# EAGLE design Super_Headphones (EAGLE 9.6.2)
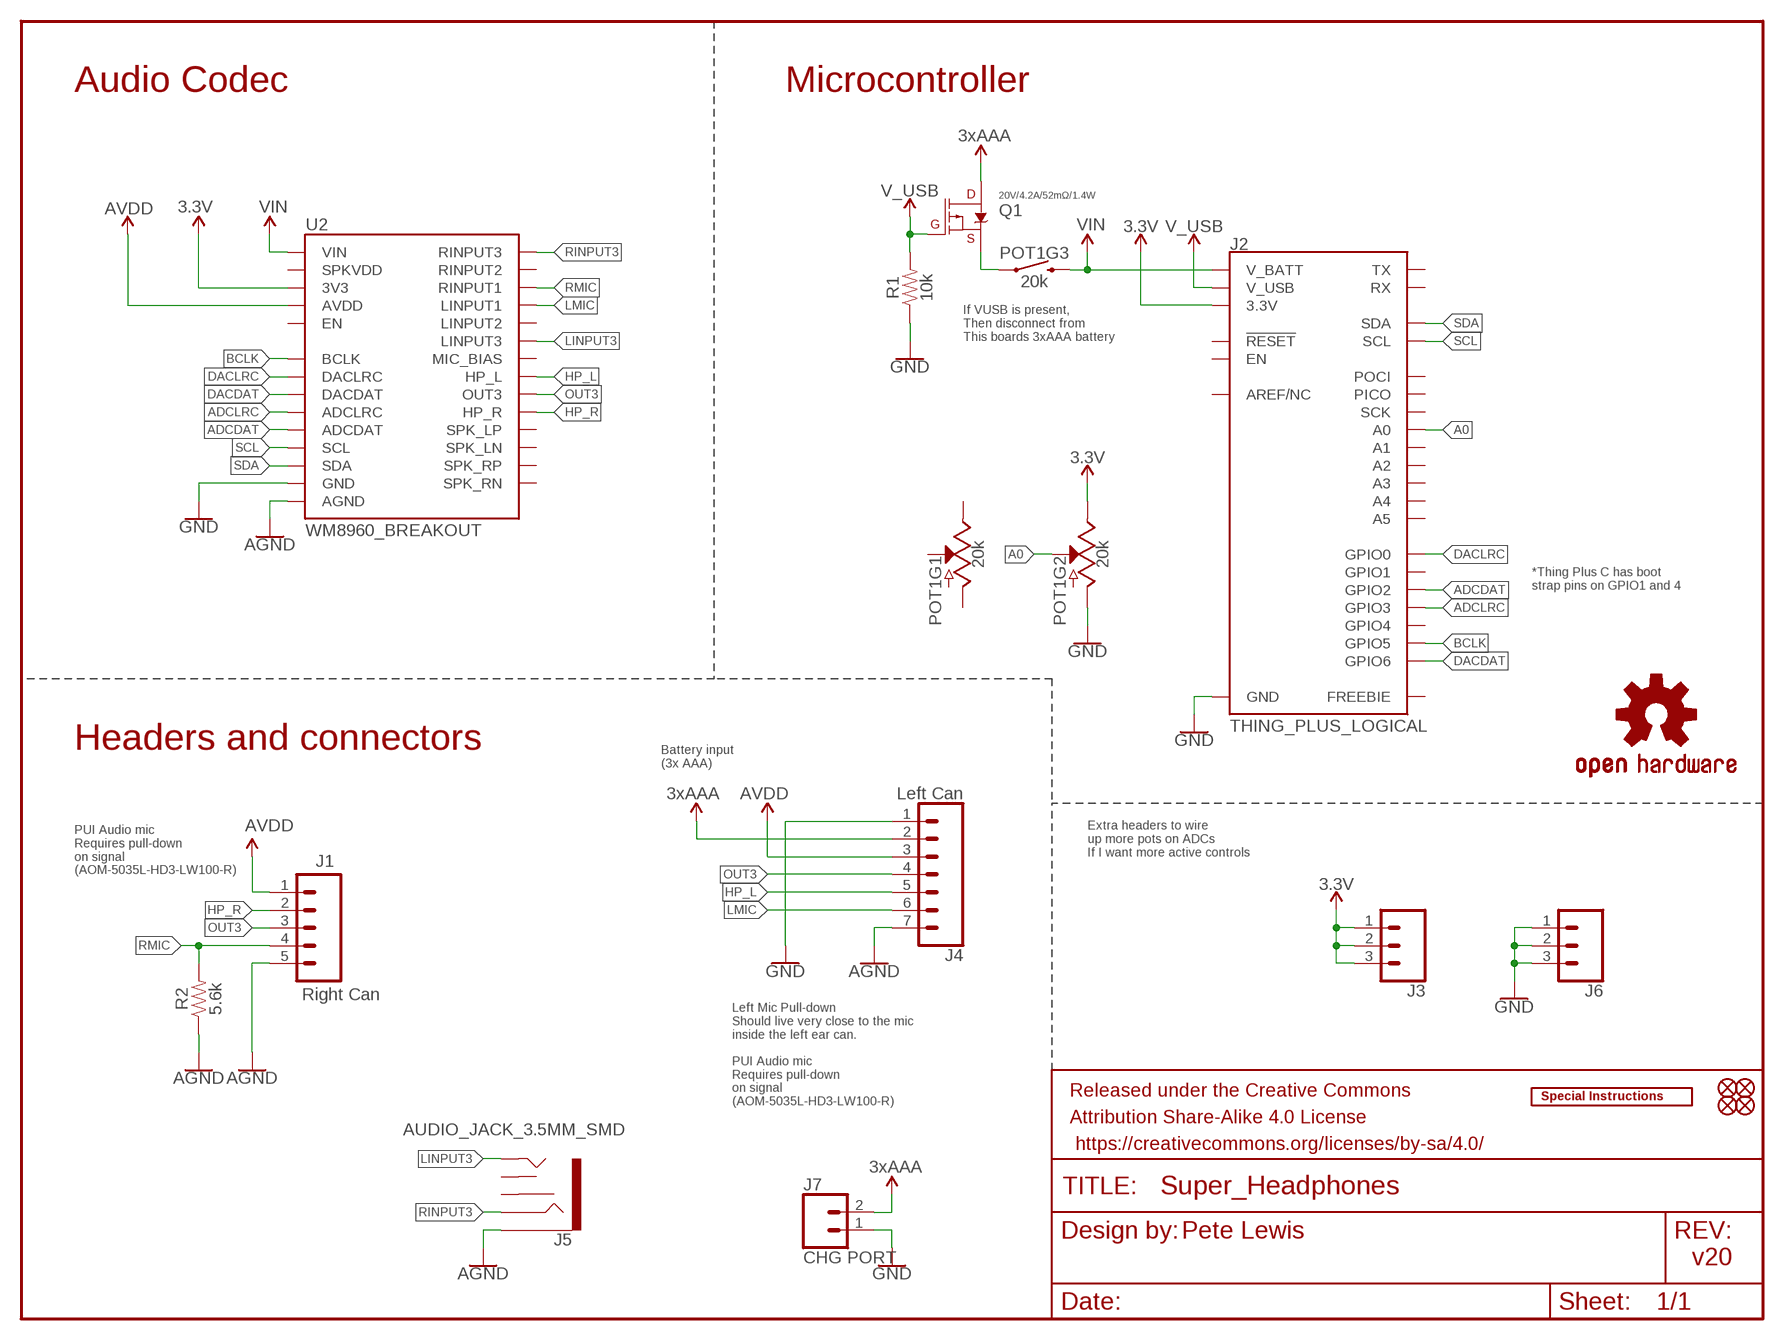
[diagram p0: schematic, sheet 1]

## Parts
FD1  FIDUCIALUFIDUCIAL  [FIDUCIAL-MICRO]
FD2  FIDUCIALUFIDUCIAL  [FIDUCIAL-MICRO]
FD3  FIDUCIALUFIDUCIAL  [FIDUCIAL-MICRO]
FD4  FIDUCIALUFIDUCIAL  [FIDUCIAL-MICRO]
FRAME2  FRAME-LETTER  [CREATIVE_COMMONS]
J1  Right Can  CONN_05NO_SILK  [1X05_NO_SILK]
J2  THING_PLUS_LOGICAL  [THING_PLUS]
J3  CONN_031X03_NO_SILK  [1X03_NO_SILK]
J4  Left Can  CONN_07NO_SILK  [1X07_NO_SILK]
J5  AUDIO_JACK_3.5MM_SMD  [AUDIO-JACK-3.5MM-SMD]
J6  CONN_031X03_NO_SILK  [1X03_NO_SILK]
J7  CHG PORT  CONN_021X02_NO_SILK  [1X02_NO_SILK]
LOGO4  OSHW-LOGOM  [OSHW-LOGO-M]
LOGO5  SPECIAL_INSTRUCTIONS-ORDERING  [ORDERING_INSTRUCTIONS]
POT1  20k  POTENTIOMETER_DUAL_W/SWITCH  [POT-DUAL-SWITCH-PTH]
Q1  20V/4.2A/52mΩ/1.4W  MOSFET_PCH-DMG2305UX-7  [SOT23-3]
R1  10k  10KOHM-0603-1/10W-1%  [0603]
R2  5.6k  5.6KOHM-0603-1/10W-1%  [0603]
U2  WM8960_BREAKOUT  [WM8960_BREAKOUT]

## Nets
3.3V: J2.27(3.3V) J3.1 J3.2 J3.3 POT1.B3(E) U2.3V3
3XAAA: J4.2 J7.2 Q1.3(D) ; supply symbol labelled 3xAAA
A0: J2.24(A0) POT1.B2(S)
ADCDAT: J2.7(GPIO2) U2.ADCDAT
ADCLRC: J2.6(GPIO3) U2.ADCLRC
AGND: J1.5 J4.7 J5.SLEEVE R2.1 U2.GND1(AGND)
AVDD: J1.1 J4.3 U2.AVDD
BCLK: J2.4(GPIO5) U2.BCLK
DACDAT: J2.3(GPIO6) U2.DACDAT
DACLRC: J2.9(GPIO0) U2.DACLRC
GND: J2.25(GND) J4.1 J6.1 J6.2 J6.3 J7.1 POT1.B1(A) R1.1 U2.GND2(GND) U2.GND3(GND) U2.GND4(GND) U2.GND5(GND) U2.GND6(GND)
HP_L: J4.5 U2.HP_L
HP_R: J1.2 U2.HP_R
LINPUT3: J5.TIP U2.LINPUT3
LMIC: J4.6 U2.LINPUT1
N$6: POT1.SW1 Q1.2(S)
OUT3: J1.3 J4.4 U2.OUT3
RINPUT3: J5.RING U2.RINPUT3
RMIC: J1.4 R2.2 U2.RINPUT1
SCL: J2.2(SCL) U2.SCL
SDA: J2.1(SDA) U2.SDA
V_USB [power]: J2.10(V_USB) Q1.1(G) R1.2
VIN: J2.12(V_BATT) POT1.SW2 U2.VIN
Unconnected: J2.5(GPIO4) J2.8(GPIO1) J2.11(EN) J2.13(FREEBIE) J2.14(TX) J2.15(RX) J2.16(POCI) J2.17(PICO) J2.18(SCK) J2.19(A5) J2.20(A4) J2.21(A3) J2.22(A2) J2.23(A1) J2.26(AREF/NC) J2.28(!RESET) J5.RSH J5.TSH POT1.A1(A) POT1.A2(S) POT1.A3(E) U2.EN U2.LINPUT2 U2.MIC_BIAS U2.RINPUT2 U2.SPK_LN U2.SPK_LP U2.SPK_RN U2.SPK_RP U2.SPKVDD

## Notes on the sheet
- Audio Codec | Microcontroller
- If VUSB is present,
  Then disconnect from
  This boards 3xAAA battery
- *Thing Plus C has boot 
  strap pins on GPIO1 and 4
- Headers and connectors
- Battery input
  (3x AAA)
- Extra headers to wire
  up more pots on ADCs
  If I want more active controls
- PUI Audio mic 
  Requires pull-down 
  on signal
  (AOM-5035L-HD3-LW100-R)
- Left Mic Pull-down
  Should live very close to the mic
  inside the left ear can.
  
  PUI Audio mic 
  Requires pull-down 
  on signal
  (AOM-5035L-HD3-LW100-R)
- Pete Lewis
- v20

## Library data of the parts
FD1-FD4 = SparkFun-Aesthetics:FIDUCIAL: Fiducial Alignment Points Point-of-reference for pick-and-place machines and other optical instruments.
FRAME2 = SparkFun-Aesthetics:FRAME-LETTER: Schematic Frame - Letter Standard 8.5x11 US Letter frame
J1 = SparkFun-Connectors:CONN_05: Multi connection point. Often used as Generic Header-pin footprint for 0.1 inch spaced/style header connections On any of the 0.1 inch spaced packages, you can populate with these: Break Away Headers - Straight <https://www.sparkfun.com/products/116> (PRT-00116) Break Away Male Headers - Right Angle <https://www.sparkfun.com/products/553> (PRT-00553) Female Headers <https://www.sparkfun.com/products/115> (PRT-00115) Break Away Headers - Machine Pin <https://www.sparkfun.com/products/117> (PRT-00117) Break Away Female Headers - Swiss Machine Pin <https://www.sparkfun.com/products/743> (PRT-00743) For SCREWTERMINALS and SPRING TERMINALS visit here: Screw Terimnals on SparkFun.com <https://www.sparkfun.com/search/results?term=Screw+Terminals> (5mm/3.5mm/2.54mm spacing) This device is also useful as a general connection point to wire up your design to another part of your project. Our various solder wires solder well into these plated through hole pads. Hook-Up Wire - Assortment (Stranded, 22 AWG) <https://www.sparkfun.com/products/11375> (PRT-11375) Hook-Up Wire - Assortment (Solid Core, 22 AWG) <https://www.sparkfun.com/products/11367> (PRT-11367) View the entire wire category on our website here <https://www.sparkfun.com/categories/141> Special notes: Molex polarized connector foot print use with SKU : PRT-08231 with associated crimp pins and housings. 1MM SMD Version SKU: PRT-10208
J2 = SparkFun-Boards:THING_PLUS_LOGICAL
J3 J6 = SparkFun-Connectors:CONN_03: Multi connection point. Often used as Generic Header-pin footprint for 0.1 inch spaced/style header connections On any of the 0.1 inch spaced packages, you can populate with these: Break Away Headers - Straight <https://www.sparkfun.com/products/116> (PRT-00116) Break Away Male Headers - Right Angle <https://www.sparkfun.com/products/553> (PRT-00553) Female Headers <https://www.sparkfun.com/products/115> (PRT-00115) Break Away Headers - Machine Pin <https://www.sparkfun.com/products/117> (PRT-00117) Break Away Female Headers - Swiss Machine Pin <https://www.sparkfun.com/products/743> (PRT-00743) Stackable Header - 3 Pin (Female, 0.1") <https://www.sparkfun.com/products/13875> (PRT-13875) For SCREWTERMINALS and SPRING TERMINALS visit here: Screw Terimnals on SparkFun.com <https://www.sparkfun.com/search/results?term=Screw+Terminals> (5mm/3.5mm/2.54mm spacing) This device is also useful as a general connection point to wire up your design to another part of your project. Our various solder wires solder well into these plated through hole pads. Hook-Up Wire - Assortment (Stranded, 22 AWG) <https://www.sparkfun.com/products/11375> (PRT-11375) Hook-Up Wire - Assortment (Solid Core, 22 AWG) <https://www.sparkfun.com/products/11367> (PRT-11367) View the entire wire category on our website here <https://www.sparkfun.com/categories/141> Special notes: Molex polarized connector foot print use with SKU : PRT-08232 with associated crimp pins and housings.
J4 = SparkFun-Connectors:CONN_07: Multi connection point. Often used as Generic Header-pin footprint for 0.1 inch spaced/style header connections On any of the 0.1 inch spaced packages, you can populate with these: Break Away Headers - Straight <https://www.sparkfun.com/products/116> (PRT-00116) Break Away Male Headers - Right Angle <https://www.sparkfun.com/products/553> (PRT-00553) Female Headers <https://www.sparkfun.com/products/115> (PRT-00115) Break Away Headers - Machine Pin <https://www.sparkfun.com/products/117> (PRT-00117) Break Away Female Headers - Swiss Machine Pin <https://www.sparkfun.com/products/743> (PRT-00743) For SCREWTERMINALS and SPRING TERMINALS visit here: Screw Terimnals on SparkFun.com <https://www.sparkfun.com/search/results?term=Screw+Terminals> (5mm/3.5mm/2.54mm spacing) This device is also useful as a general connection point to wire up your design to another part of your project. Our various solder wires solder well into these plated through hole pads. Hook-Up Wire - Assortment (Stranded, 22 AWG) <https://www.sparkfun.com/products/11375> (PRT-11375) Hook-Up Wire - Assortment (Solid Core, 22 AWG) <https://www.sparkfun.com/products/11367> (PRT-11367) View the entire wire category on our website here <https://www.sparkfun.com/categories/141> Special notes: Molex polarized connector foot print use with SKU : PRT-08231 with associated crimp pins and housings. 1MM SMD Version SKU: PRT-10208 NOTES ON THE VARIANTS LOCK and LOCK_LONGPADS... This footprint was designed to help hold the alignment of a through-hole component (i.e. 6-pin header) while soldering it into place. You may notice that each hole has been shifted either up or down by 0.005 of an inch from it's more standard position (which is a perfectly straight line). This slight alteration caused the pins (the squares in the middle) to touch the edges of the holes. Because they are alternating, it causes a "brace" to hold the component in place. 0.005 has proven to be the perfect amount of "off-center" position when using our standard breakaway headers. Although looks a little odd when you look at the bare footprint, once you have a header in there, the alteration is very hard to notice. Also,if you push a header all the way into place, it is covered up entirely on the bottom side.
J5 = SparkFun-Connectors:AUDIO_JACK_3.5MM: Audio Jack 3.5mm variants of PTH and SMT stereo audio jack with bypass switches. SparkFun Products: SparkFun SparkPunk Sound Kit <[https://www.sparkfun.com/products/11177]> - PTH MP3 Trigger <https://www.sparkfun.com/products/13720> -3.5mm SMD SparkFun PicoBoard <https://www.sparkfun.com/products/11888>- 2.5mm SMD; PROD_ID: CONN-10353
J7 = SparkFun-Connectors:CONN_02: Multi connection point. Often used as Generic Header-pin footprint for 0.1 inch spaced/style header connections On any of the 0.1 inch spaced packages, you can populate with these: Break Away Headers - Straight <https://www.sparkfun.com/products/116> (PRT-00116) Break Away Male Headers - Right Angle <https://www.sparkfun.com/products/553> (PRT-00553) Female Headers <https://www.sparkfun.com/products/115> (PRT-00115) Break Away Headers - Machine Pin <https://www.sparkfun.com/products/117> (PRT-00117) Break Away Female Headers - Swiss Machine Pin <https://www.sparkfun.com/products/743> (PRT-00743) For SCREWTERMINALS and SPRING TERMINALS visit here: Screw Terimnals on SparkFun.com <https://www.sparkfun.com/search/results?term=Screw+Terminals> (5mm/3.5mm/2.54mm spacing) This device is also useful as a general connection point to wire up your design to another part of your project. Our various solder wires solder well into these plated through hole pads. Hook-Up Wire - Assortment (Stranded, 22 AWG) <https://www.sparkfun.com/products/11375> (PRT-11375) Hook-Up Wire - Assortment (Solid Core, 22 AWG) <https://www.sparkfun.com/products/11367> (PRT-11367) View the entire wire category on our website here <https://www.sparkfun.com/categories/141> Special notes: Molex polarized connector foot print use with: PRT-08233 with associated crimp pins and housings. 2.54_SCREWTERM for use with PRT-10571. 3.5mm Screw Terminal footprints for PRT-08084 5mm Screw Terminal footprints for use with PRT-08432
LOGO4 = SparkFun-Aesthetics:OSHW-LOGO: Open-Source Hardware (OSHW) Logo This logo indicates the piece of hardware it is found on incorporates a OSHW license and/or adheres to the definition of open source hardware found here: http://freedomdefined.org/OSHW
LOGO5 = SparkFun-Aesthetics:SPECIAL_INSTRUCTIONS: Special Ordering/Production Instructions Alert Symbol for special PCB ordering instructions or unique production process warnings. Ordering Instructions Production Instructions Types of information that should be added to box: Copper weight Soldermask color Silk color PCB thickness Number of layers PCB Standard: 1.6mm FR4 1 oz copper immersion silver plating red soldermask white silkscreen Types of information that should be added to box: Special wash requirements Depaneling instructions Humidification Glue curing Default text settings: 0.07 inch 9% ratio 50% line distance
POT1 = SparkFun-Resistors:POTENTIOMETER_DUAL_W/SWITCH; PROD_ID: RES-13814
Q1 = SparkFun-DiscreteSemi:MOSFET_PCH: P-channel MOSFETs Voltage controlled devices that allow control of high current outputs. SparkFun Products: SparkFun ESP32 Thing <https://www.sparkfun.com/products/13907> SparkFun ESP8266 Thing <https://www.sparkfun.com/products/13231> SparkFun Pi Servo HAT V2 <https://www.sparkfun.com/products/15316> DMG2305UX-7 (20V/4.2A/SOT23-3); PROD_ID: TRANS-14388
R1 = SparkFun-Resistors:10KOHM: 10kΩ resistor A resistor is a passive two-terminal electrical component that implements electrical resistance as a circuit element. Resistors act to reduce current flow, and, at the same time, act to lower voltage levels within circuits. - Wikipedia; PROD_ID: RES-00824
R2 = SparkFun-Resistors:5.6KOHM: 5.6kΩ resistor A resistor is a passive two-terminal electrical component that implements electrical resistance as a circuit element. Resistors act to reduce current flow, and, at the same time, act to lower voltage levels within circuits. - Wikipedia; PROD_ID: RES-12378
U2 = wm8960:WM8960_BREAKOUT

## Net classes
0 default: width 0.127 mm, drill 0.305 mm
1 power: width 0.305 mm, drill 0.305 mm

## Board
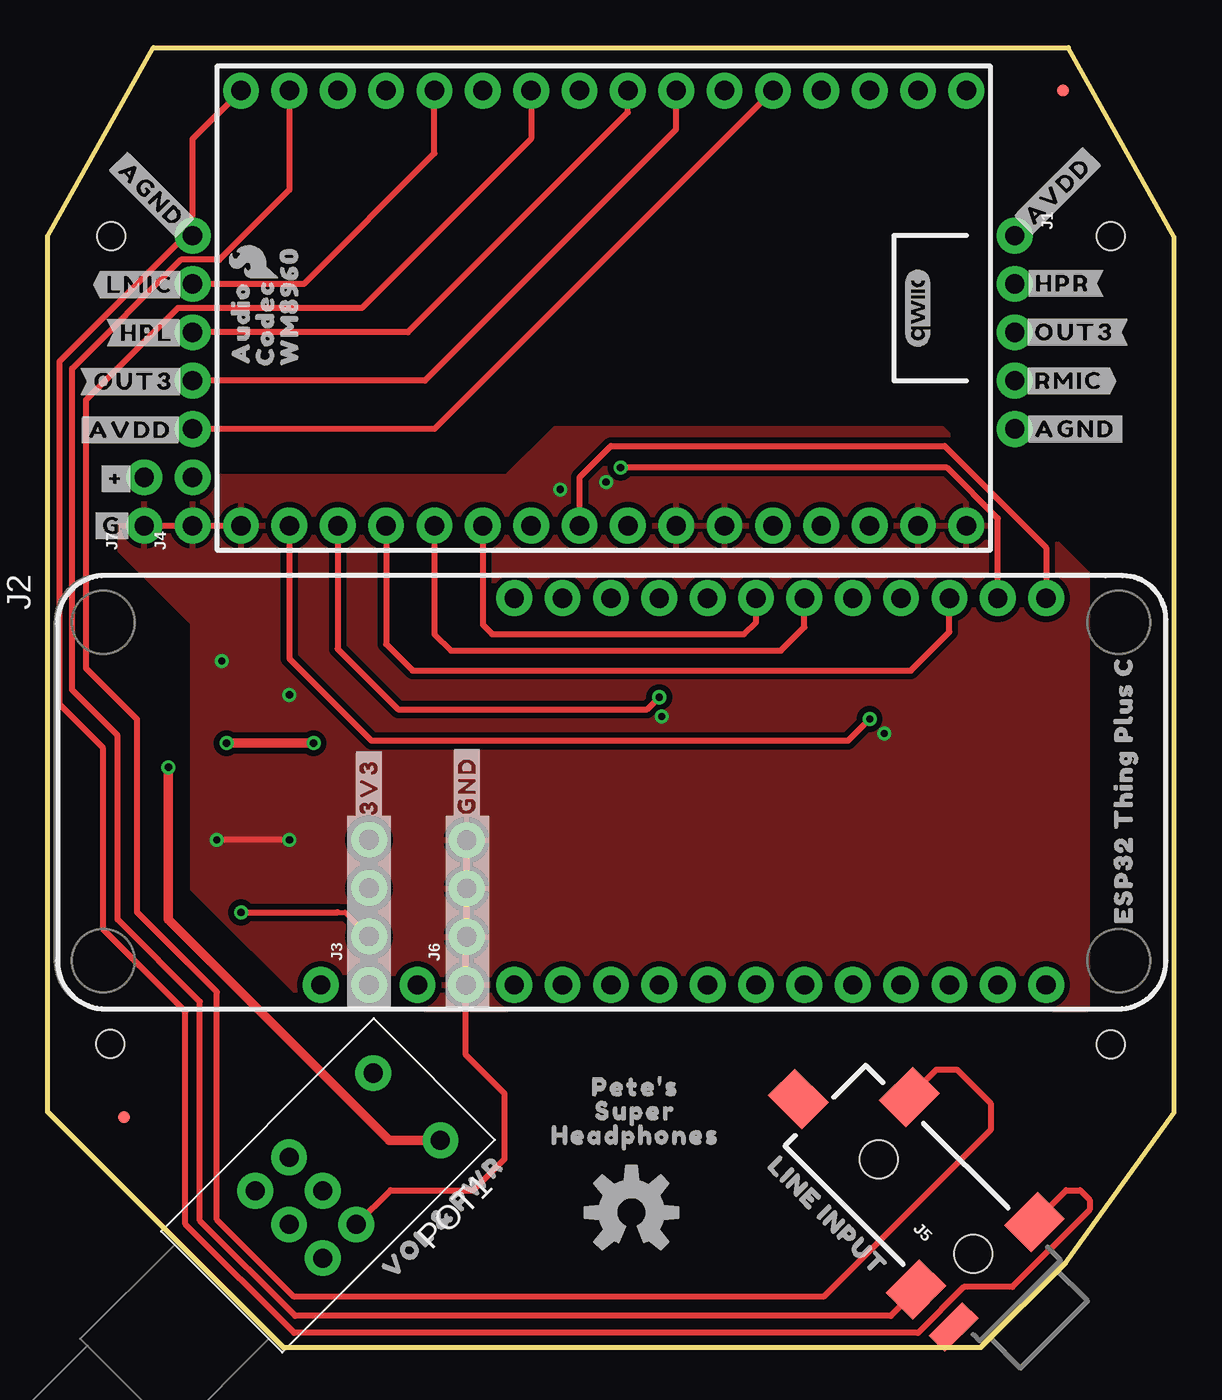
[diagram p1: board, top side]
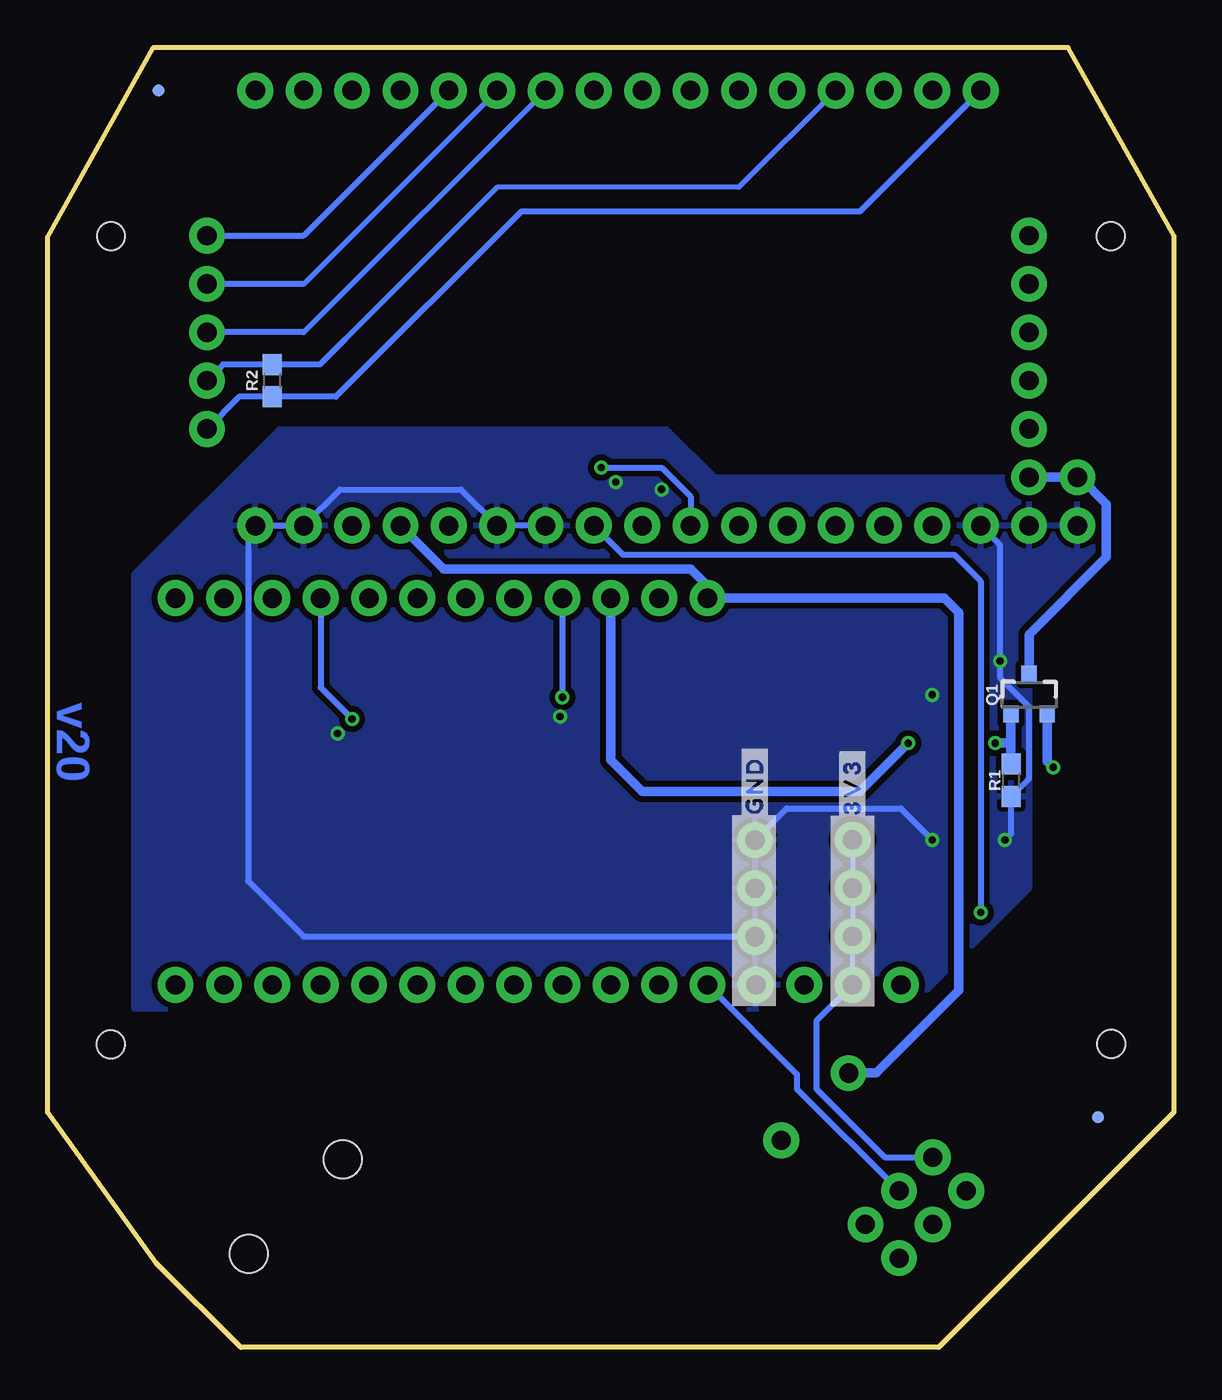
[diagram p2: board, bottom side, seen from below]

Size 59.17 x 68.3 mm. Coordinates in mm from the lower left corner, seen from the top.
Outline: 12.37,0 49.02,0 53.47,4.42 59.17,12.35 59.17,58.35 53.62,68.3 5.56,68.3 0,58.4 0,12.37 12.37,0
Copper layers (1+2*15+16): Top 0.035559375mm / dielectric 0.47751875mm / Route2 0.035559375mm / dielectric 0.47751875mm / Route15 0.035559375mm / dielectric 0.47751875mm / Bottom 0.035559375mm
Design rules "SparkFun-4-Layer-General-JLCPCB": minimum track width 7mil, minimum drill 12mil, track to track 7mil, track to pad 7mil, pad to pad 7mil, via to via 7mil, smd to smd 7mil, copper to edge 7mil, drill to drill 7mil, minimum pad ring 7mil, minimum via ring 7mil, stop-mask expansion 3mil, vias tented up to drill 25mil, thermal gap 10mil
Holes 1.47 mm at 3.33,58.39 55.84,58.39 55.85,15.93 3.3,15.94

### Footprints (pad centres in the part's own frame; a part is rotated, then mirrored left to right if it is on the bottom)
FIDUCIAL-MICRO = smd 0.635 x 0.635: 1 0,0
1X05_NO_SILK = drill 1.016 pad 1.88: 1 0,0; 2 2.54,0; 3 5.08,0; 4 7.62,0; 5 10.16,0
THING_PLUS = drill 1.016 pad 1.88: 1 1.27,52.07; 2 1.27,49.53; 3 1.27,46.99; 4 1.27,44.45; 5 1.27,41.91; 6 1.27,39.37; 7 1.27,36.83; 8 1.27,34.29; 9 1.27,31.75; 10 1.27,29.21; 11 1.27,26.67; 12 1.27,24.13; 13 21.59,52.07; 14 21.59,49.53; 15 21.59,46.99; 16 21.59,44.45; 17 21.59,41.91; 18 21.59,39.37; 19 21.59,36.83; 20 21.59,34.29; 21 21.59,31.75; 22 21.59,29.21; 23 21.59,26.67; 24 21.59,24.13; 25 21.59,21.59; 26 21.59,19.05; 27 21.59,16.51; 28 21.59,13.97
1X03_NO_SILK = drill 1.016 pad 1.88: 1 0,0; 2 2.54,0; 3 5.08,0
1X07_NO_SILK = drill 1.016 pad 1.88: 1 0,0; 2 2.54,0; 3 5.08,0; 4 7.62,0; 5 10.16,0; 6 12.7,0; 7 15.24,0
AUDIO-JACK-3.5MM-SMD = smd 2 x 2.5: RING 4.3,3.45; SLEEVE 2.4,-3.45; TIP 11.7,-3.45 | smd 1.2 x 2.5: RSH 1.5,3.45 | smd 2.5 x 2: TSH 15.75,0.75 | hole 2: 3.5,0; 10.5,0
1X02_NO_SILK = drill 1.016 pad 1.88: 1 0,0; 2 2.54,0
POT-DUAL-SWITCH-PTH = drill 1 pad 1.88: A1 2.54,2.5; A2 2.54,0; A3 2.54,-2.5; B1 0.04,2.5; B2 0.04,0; B3 0.04,-2.5; SW1 -6.21,2.5; SW2 -6.21,-2.5
SOT23-3 = smd 0.8 x 0.9: 1 -0.95,-1; 2 0.95,-1; 3 0,1.1
0603 = smd 1.1 x 1: 1 -0.85,0; 2 0.85,0
WM8960_BREAKOUT = drill 1.016 pad 1.88: 3V3 -11.43,0; ADCDAT -11.43,7.62; ADCLRC -11.43,10.16; AVDD 11.43,-7.62; BCLK -11.43,17.78; DACDAT -11.43,12.7; DACLRC -11.43,15.24; EN -11.43,-12.7; GND1 11.43,20.32; GND2 -11.43,20.32; GND3 -11.43,-2.54; GND4 -11.43,-5.08; GND5 -11.43,-15.24; GND6 -11.43,-17.78; HP_L 11.43,0; HP_R 11.43,-5.08; LINPUT1 11.43,10.16; LINPUT2 11.43,7.62; LINPUT3 11.43,5.08; MIC_BIAS 11.43,2.54; OUT3 11.43,-2.54; RINPUT1 11.43,12.7; RINPUT2 11.43,15.24; RINPUT3 11.43,17.78; SCL -11.43,5.08; SDA -11.43,2.54; SPK_LN 11.43,-12.7; SPK_LP 11.43,-10.16; SPK_RN 11.43,-17.78; SPK_RP 11.43,-15.24; SPKVDD -11.43,-7.62; VIN -11.43,-10.16

### Placement (x,y rotation side)
FD1  4,12.11 0 top
FD2  4,12.11 0 bottom
FD3  53.34,66.04 0 bottom
FD4  53.34,66.04 0 top
FRAME2  6.35,-22.86 0 top  (outside the outline)
J1  50.8,58.42 270 top
J2  0.38,40.64 270 top
J3  16.89,21.6 90 top
J4  7.62,43.18 90 top
J5  51.1,2.45 135 top
J6  22.01,21.57 90 top
J7  5.08,43.18 90 top
LOGO4  30.67,7.09 0 top
LOGO5  80.01,59.69 0 top  (outside the outline)
POT1  14.48,8.26 225 top
Q1  7.62,34.29 0 bottom
R1  8.55,29.8 90 bottom
R2  47.37,50.8 90 bottom
U2  30.48,54.61 90 top
U$2  [#AGND#0]  5.46,60.58 315 top
U$5  [#LMIC#503]  4.86,55.85 0 top
U$6  [#HPL#504]  5.2,53.31 0 top
U$7  [#OUT3#505]  4.53,50.76 0 top
U$8  [#AVDD#505]  4.34,48.21 0 top
U$9  [###507]  3.59,45.64 0 top
U$10  [#HPR#509]  53.32,55.91 0 top
U$11  [#OUT3#510]  53.94,53.34 0 top
U$13  [#AVDD#505]  53.06,60.78 45 top
U$14  [#RMIC#510]  53.65,50.79 0 top
U$15  [LINE_INPUT512]  40.99,6.9 315 top
U$16  [VOL_#_PWR513]  20.78,6.86 45 top
U$17  [#AGND#0]  53.98,48.26 0 top
U$18  [#G#514]  3.38,43.17 0 top
U$19  [PETE#S516]  30.87,13.69 0 top
U$20  [SUPER517]  30.87,12.42 0 top
U$21  [HEADPHONES518]  30.87,11.15 0 top
U$22  [#GND#502]  22.02,29.52 90 top
U$23  [#GND#502]  22.03,29.52 90 bottom
U$24  [#3V3#519]  16.88,29.44 90 top
U$25  [#3V3#519]  16.9,29.44 90 bottom
U$26  [ESP32_THING_PLUS_C519]  56.52,29.28 90 top

### Tracks (layer width: path | path; a pad name or v marks a point on that pad's centre or on a via)
3.3V  (via drill 0.38)
  Top 0.254: 15.24,22.86 15.63,22.86 J3.1
  Top 0.305: v10.16,22.86 15.24,22.86
  Bottom 0.254: J2.27 J3.1 J3.2 J3.3
  Bottom 0.305: U2.3V3 28.96,41.66 11.56,41.66 10.16,40.26 v10.16,22.86 | J2.27 18.8,17.14 18.8,13.59 15.2,9.99 POT1.B3
3XAAA
  Bottom 0.508: Q1.3 7.62,37.47 3.56,41.53 3.56,44.32 4.95,45.72 J7.2 J4.2
A0
  Bottom 0.305: J2.24 19.81,14.35 19.81,13.59 POT1.B2
ADCDAT
  Top 0.305: U2.ADCDAT 22.86,37.97 23.35,37.48 36.59,37.48 37.21,38.1 J2.7
ADCLRC
  Top 0.305: U2.ADCLRC 20.32,37.47 21.18,36.61 38.51,36.61 39.75,37.85 J2.6
AGND
  Top 0.305: U2.GND1 7.62,63.5 J4.7 7.24,58.42 0.64,51.82 0.64,33.78 2.92,31.5 2.92,21.97 7.24,17.65 7.24,6.48 12.95,0.76 45.72,0.76 48.13,3.17 50.67,3.17 54.74,7.24 54.74,7.75 54.23,8.26 53.51,8.26 J5.SLEEVE
  Bottom 0.305: U2.GND1 16.51,59.69 34.29,59.69 44.03,49.95 R2.1 49.11,49.95 J1.5
AVDD
  Top 0.305: J4.3 20.32,48.26 U2.AVDD
  Bottom 0.305: J1.1 45.72,58.42 U2.AVDD
BCLK  (via drill 0.38)
  Top 0.305: U2.BCLK 12.7,36.2 17.02,31.88 42.04,31.88 v43.18,33.02
  Bottom 0.305: J2.4 44.83,34.67 v43.18,33.02
DACDAT
  Top 0.305: U2.DACDAT 17.78,36.96 19.18,35.56 45.34,35.56 47.37,37.59 J2.3
DACLRC  (via drill 0.38)
  Top 0.305: U2.DACLRC 15.24,36.7 18.41,33.53 31.5,33.53 v32.13,34.16
  Bottom 0.305: J2.9 v32.13,34.16
GND  (via drill 0.38)
  Top 0.305: POT1.B1 18.01,8.26 22.35,8.26 24,9.91 24,13.34 21.97,15.37 J2.25 21.97,21.53 J6.1 J6.2 J6.3 | v12.7,26.67 v8.89,26.67 | J7.1 J4.1 U2.GND2
  Bottom 0.305: U2.GND3 U2.GND4 37.47,45.09 43.81,45.09 U2.GND5 U2.GND6 48.64,42.8 48.64,24.51 45.72,21.59 22.03,21.59 J6.1 | J6.3 20.35,28.32 14.35,28.32 v12.7,26.67 | v8.89,26.67 8.55,27 R1.1 7.62,29.88 7.62,33.66 8.03,34.07 8.04,34.07 9.14,35.18 9.14,42.16 U2.GND2
  other vias: 43.94,32.26 32.26,33.15 12.7,34.29 9.14,36.07 29.34,45.47 26.92,45.09
  pour Top (isolate 0.305): 54.61,40.64 46.99,48.26 26.67,48.26 24.13,45.72 3.81,45.72 3.81,41.91 7.62,38.1 7.62,24.13 13.97,17.78 54.61,17.78
  pour Bottom (isolate 0.305): 54.61,40.64 46.99,48.26 26.67,48.26 24.13,45.72 3.81,45.72 3.81,41.91 7.62,38.1 7.62,24.13 13.97,17.78 54.61,17.78
HP_L
  Top 0.305: U2.HP_L 30.48,64.9 18.92,53.34 J4.5
HP_R
  Bottom 0.254: U2.HP_R 45.72,55.88
  Bottom 0.305: 45.72,55.88 J1.2
LINPUT3
  Top 0.305: U2.LINPUT3 25.4,63.5 16.51,54.61 6.84,54.61 2.01,49.78 2.01,35.69 4.7,33 4.7,22.86 8.89,18.67 8.89,6.71 12.93,2.67 40.77,2.67 49.53,11.43 49.53,12.83 47.75,14.61 46.7,14.61 J5.TIP
LMIC
  Top 0.305: U2.LINPUT1 20.32,62.74 13.46,55.88 J4.6
N$6  (via drill 0.38)
  Top 0.508: POT1.SW1 17.95,10.88 6.35,22.48 v6.35,30.48
  Bottom 0.508: v6.35,30.48 6.67,30.8 Q1.2
OUT3
  Top 0.305: U2.OUT3 33.02,64.01 19.81,50.8 J4.4
  Bottom 0.254: U2.OUT3 45.72,53.34
  Bottom 0.305: 45.72,53.34 J1.3
RINPUT3
  Top 0.305: J5.RING 45.62,2.97 44.3,1.65 13,1.65 8,6.65 8,18.16 3.68,22.48 3.68,32.15 1.29,34.54 1.29,51.44 7,57.15 9.02,57.15 12.7,60.83 U2.RINPUT3
RMIC
  Bottom 0.254: U2.RINPUT1 22.86,60.96 35.56,60.96 43.56,52.96
  Bottom 0.305: J1.4 49.95,51.65 R2.2 44.87,51.65 43.56,52.96
SCL  (via drill 0.38)
  Top 0.305: J2.2 49.91,43.56 47.24,46.23 v30.1,46.23
  Bottom 0.305: v30.1,46.23 26.92,46.23 25.4,44.7 U2.SCL
SDA
  Top 0.305: U2.SDA 27.94,45.72 29.59,47.37 47.12,47.37 52.45,42.04 J2.1
V_USB  (via drill 0.38)
  Top 0.508: v13.97,31.75 v9.4,31.75
  Bottom 0.508: Q1.1 8.57,31.75 | 8.57,31.75 8.57,30.66 R1.2 | J2.10 29.59,30.86 27.94,29.21 16.51,29.21 v13.97,31.75 | v9.4,31.75 8.57,31.75
VIN
  Bottom 0.508: POT1.SW2 15.65,14.41 11.3,18.76 11.3,38.61 12.06,39.37 J2.12 24.51,40.01 25.4,40.89 38.35,40.89 U2.VIN

### Text on the board
Bottom: v20
Measures: UNITS: INCHES
tDocu: PCB Thickness: 0.8mm | Pete Lewis